# EAGLE design octosonar (EAGLE 8.2.1)
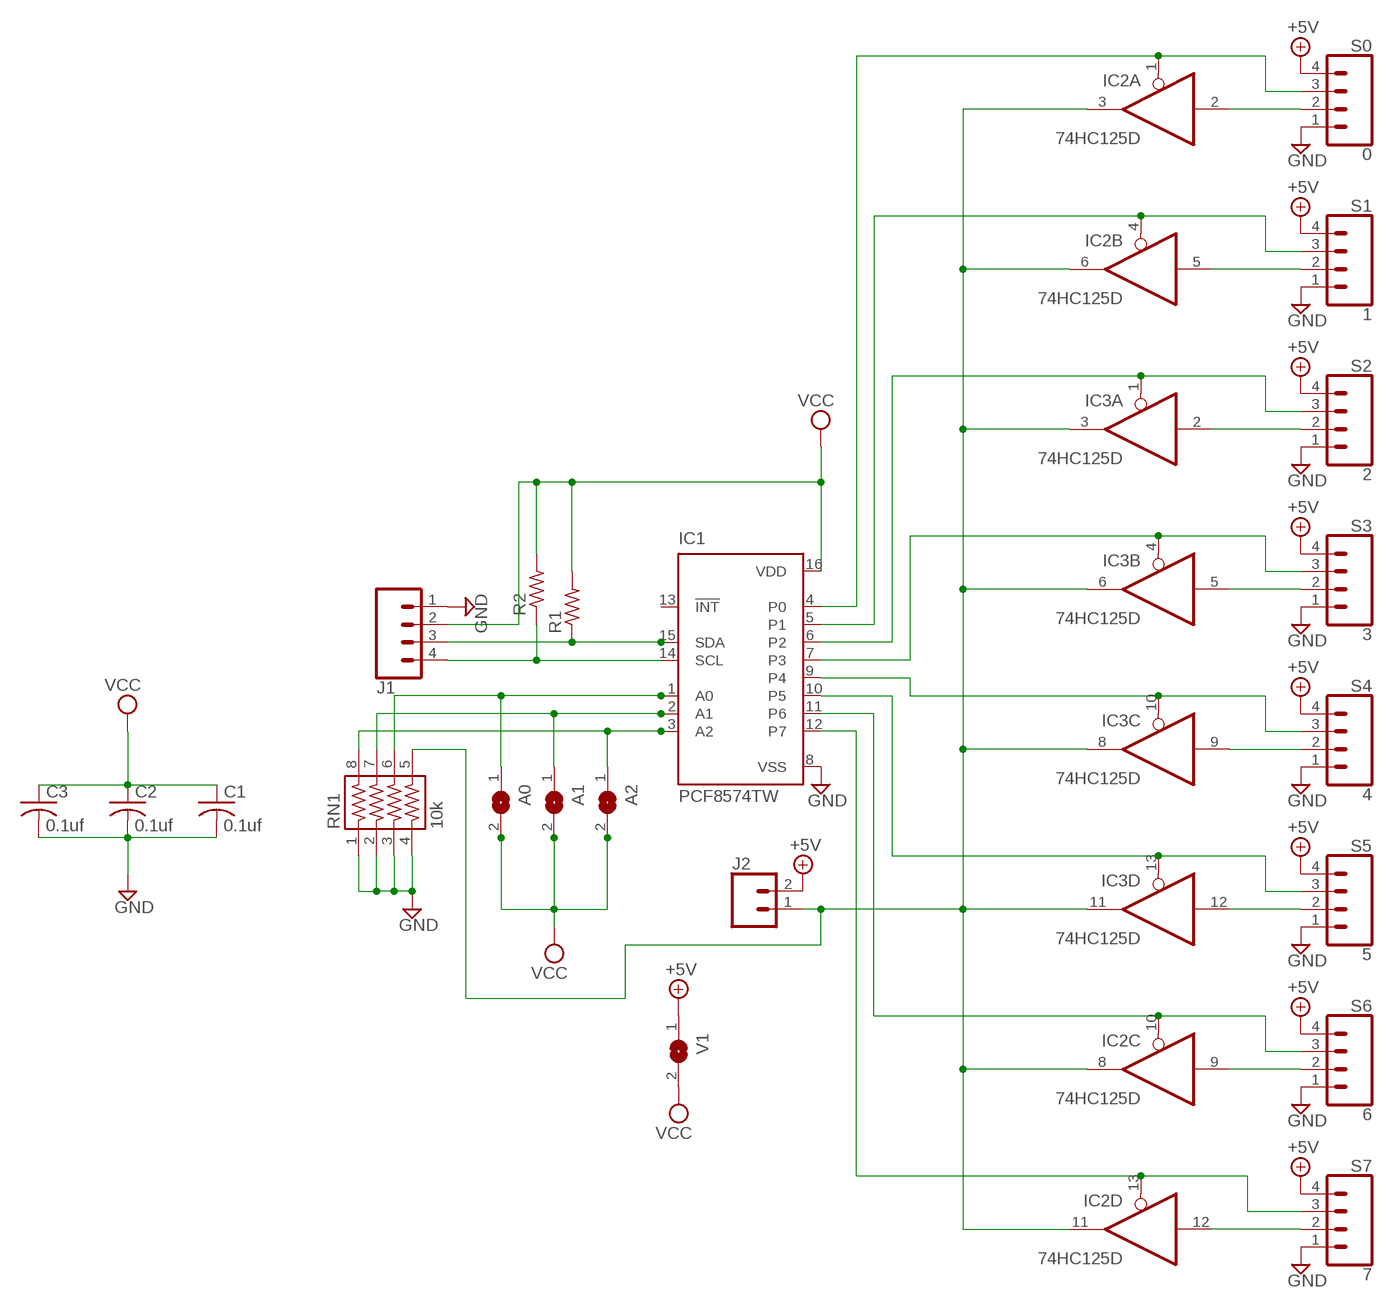
[diagram p0: schematic, sheet 1]

## Parts
A0  SJ  [SJ]
A1  SJ  [SJ]
A2  SJ  [SJ]
C1  0.1uf  C-USC0805  [C0805]
C2  0.1uf  C-USC0805  [C0805]
C3  0.1uf  C-USC0805  [C0805]
IC1  PCF8574TW  [SO16W]
IC2  74HC125D  [SO14]
IC3  74HC125D  [SO14]
J1  CONN_04POLAR_LOCK  [MOLEX-1X4_LOCK]
J2  CONN_02POLAR_LOCK  [MOLEX-1X2_LOCK]
R1  R-US_0204/2V  [0204V]
R2  R-US_0204/2V  [0204V]
RN1  10k  743-8  [743-8]
S0  0  CONN_04POLAR_LOCK  [MOLEX-1X4_LOCK]
S1  1  CONN_04POLAR_LOCK  [MOLEX-1X4_LOCK]
S2  2  CONN_04POLAR_LOCK  [MOLEX-1X4_LOCK]
S3  3  CONN_04POLAR_LOCK  [MOLEX-1X4_LOCK]
S4  4  CONN_04POLAR_LOCK  [MOLEX-1X4_LOCK]
S5  5  CONN_04POLAR_LOCK  [MOLEX-1X4_LOCK]
S6  6  CONN_04POLAR_LOCK  [MOLEX-1X4_LOCK]
S7  7  CONN_04POLAR_LOCK  [MOLEX-1X4_LOCK]
V1  SJ  [SJ]

## Nets
+5V: J2.2 S0.4 S1.4 S2.4 S3.4 S4.4 S5.4 S6.4 S7.4 V1.1
GND: C1.2 C2.2 C3.2 IC1.8(VSS) J1.1 RN1.1 RN1.2 RN1.3 RN1.4 S0.1 S1.1 S2.1 S3.1 S4.1 S5.1 S6.1 S7.1
N$1: IC1.4(P0) IC2.1(A:OE) S0.3
N$2: IC1.5(P1) IC2.4(B:OE) S1.3
N$3: IC1.6(P2) IC3.1(A:OE) S2.3
N$4: IC1.7(P3) IC3.4(B:OE) S3.3
N$5: IC1.9(P4) IC3.10(C:OE) S4.3
N$6: IC1.10(P5) IC3.13(D:OE) S5.3
N$7: IC1.11(P6) IC2.10(C:OE) S6.3
N$8: IC1.12(P7) IC2.13(D:OE) S7.3
N$9: IC2.2(A:I) S0.2
N$10: IC2.5(B:I) S1.2
N$11: IC3.2(A:I) S2.2
N$12: IC3.5(B:I) S3.2
N$13: IC3.12(D:I) S5.2
N$14: IC2.9(C:I) S6.2
N$15: IC2.12(D:I) S7.2
N$16: IC3.9(C:I) S4.2
N$17: IC2.3(A:O) IC2.6(B:O) IC2.8(C:O) IC2.11(D:O) IC3.3(A:O) IC3.6(B:O) IC3.8(C:O) IC3.11(D:O) J2.1 RN1.5
N$18: A2.1 IC1.3(A2) RN1.8
N$19: A1.1 IC1.2(A1) RN1.7
N$20: A0.1 IC1.1(A0) RN1.6
N$21: IC1.14(SCL) J1.4 R2.1
N$22: IC1.15(SDA) J1.3 R1.1
VCC: A0.2 A1.2 A2.2 C1.1 C2.1 C3.1 IC1.16(VDD) J1.2 R1.2 R2.2 V1.2
Unconnected: IC1.13(!INT)

## Power pins joined to a net without a drawn wire
GND: IC2.7(P:GND) IC3.7(P:GND)
VCC: IC2.14(P:VCC) IC3.14(P:VCC)

## Library data of the parts
A0 A1 A2 V1 = jumper:SJ: SMD solder JUMPER
C1-C3 = resistor:C-US: CAPACITOR, American symbol
IC1 = micro-philips:PCF8574: I2C-Bus Remote 8-bit I/O expander http://www.semiconductors.philips.com/acrobat_download/datasheets/PCF8574_4.pdf; MPN: PCF8574T/3,512; OC_FARNELL: 1201255; OC_NEWARK: 70R6870
IC2 IC3 = 74xx-eu:74*125: Quad bus BUFFER, 3-state
J1 S0 S1-S7 = SparkFun-Connectors:CONN_04: Multi connection point. Often used as Generic Header-pin footprint for 0.1 inch spaced/style header connections On any of the 0.1 inch spaced packages, you can populate with these: Break Away Headers - Straight <https://www.sparkfun.com/products/116> (PRT-00116) Break Away Male Headers - Right Angle <https://www.sparkfun.com/products/553> (PRT-00553) Female Headers <https://www.sparkfun.com/products/115> (PRT-00115) Break Away Headers - Machine Pin <https://www.sparkfun.com/products/117> (PRT-00117) Break Away Female Headers - Swiss Machine Pin <https://www.sparkfun.com/products/743> (PRT-00743) For SCREWTERMINALS and SPRING TERMINALS visit here: Screw Terimnals on SparkFun.com <https://www.sparkfun.com/search/results?term=Screw+Terminals> (5mm/3.5mm/2.54mm spacing) This device is also useful as a general connection point to wire up your design to another part of your project. Our various solder wires solder well into these plated through hole pads. Hook-Up Wire - Assortment (Stranded, 22 AWG) <https://www.sparkfun.com/products/11375> (PRT-11375) Hook-Up Wire - Assortment (Solid Core, 22 AWG) <https://www.sparkfun.com/products/11367> (PRT-11367) View the entire wire category on our website here <https://www.sparkfun.com/categories/141> Special notes: Molex polarized connector foot print use with SKU : PRT-08231 with associated crimp pins and housings. 1MM SMD Version SKU: PRT-10208; PROD_ID: CONN-08186; SF_ID: PRT-08231
J2 = SparkFun-Connectors:CONN_02: Multi connection point. Often used as Generic Header-pin footprint for 0.1 inch spaced/style header connections On any of the 0.1 inch spaced packages, you can populate with these: Break Away Headers - Straight <https://www.sparkfun.com/products/116> (PRT-00116) Break Away Male Headers - Right Angle <https://www.sparkfun.com/products/553> (PRT-00553) Female Headers <https://www.sparkfun.com/products/115> (PRT-00115) Break Away Headers - Machine Pin <https://www.sparkfun.com/products/117> (PRT-00117) Break Away Female Headers - Swiss Machine Pin <https://www.sparkfun.com/products/743> (PRT-00743) For SCREWTERMINALS and SPRING TERMINALS visit here: Screw Terimnals on SparkFun.com <https://www.sparkfun.com/search/results?term=Screw+Terminals> (5mm/3.5mm/2.54mm spacing) This device is also useful as a general connection point to wire up your design to another part of your project. Our various solder wires solder well into these plated through hole pads. Hook-Up Wire - Assortment (Stranded, 22 AWG) <https://www.sparkfun.com/products/11375> (PRT-11375) Hook-Up Wire - Assortment (Solid Core, 22 AWG) <https://www.sparkfun.com/products/11367> (PRT-11367) View the entire wire category on our website here <https://www.sparkfun.com/categories/141> Special notes: Molex polarized connector foot print use with: PRT-08233 with associated crimp pins and housings. 2.54_SCREWTERM for use with PRT-10571. 3.5mm Screw Terminal footprints for PRT-08084 5mm Screw Terminal footprints for use with PRT-08432; SF_ID: PRT-09918
R1 R2 = rcl:R-US_: RESISTOR, American symbol
RN1 = resistor-array:743-8: CTS 743 Series 8 Terminations, 4 Resistors

## Board
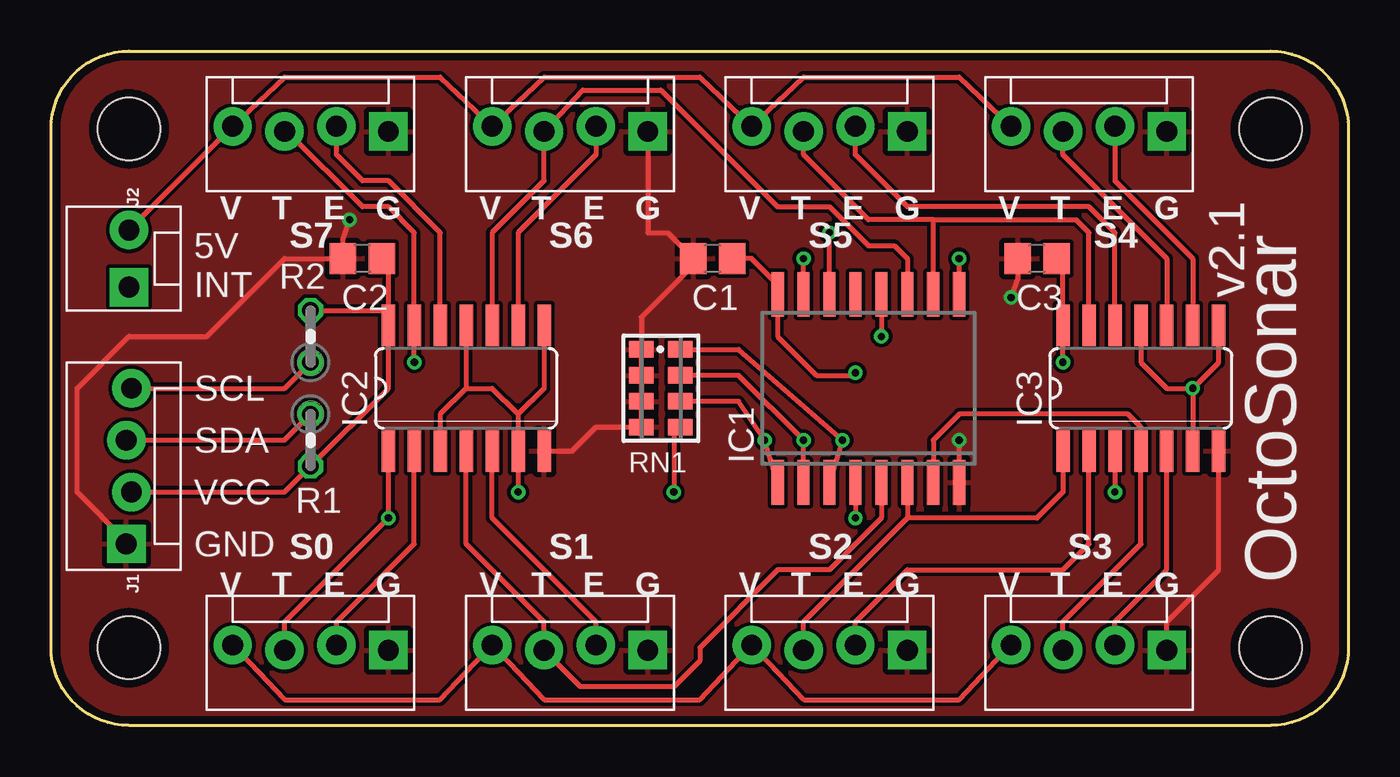
[diagram p1: board, top side]
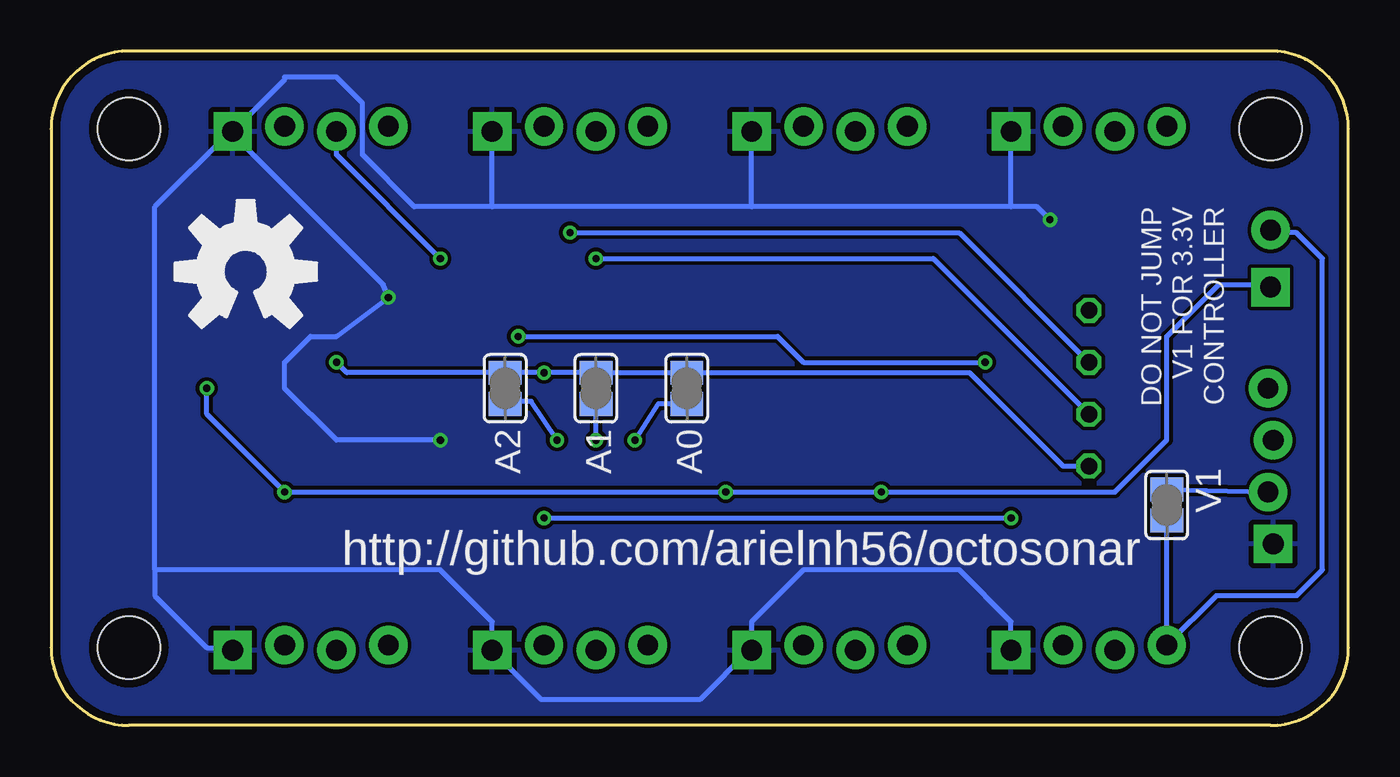
[diagram p2: board, bottom side, seen from below]

Size 63.5 x 33.02 mm. Coordinates in mm from the lower left corner, seen from the top.
Outline: 3.81,0 59.69,0 arc90 63.5,3.81 63.5,29.21 arc90 59.69,33.02 3.81,33.02 arc90 0,29.21 0,3.81 arc90 3.81,0
Copper layers (1*16): Top 0.0356mm / dielectric 1.5011mm / Bottom 0.0356mm
Design rules "mypcbway *": minimum track width 6mil, minimum drill 13mil, track to track 7mil, track to pad 7mil, pad to pad 7mil, via to via 7mil, smd to smd 7mil, copper to edge 15mil, drill to drill 6mil, minimum pad ring 7mil, minimum via ring 7mil, stop-mask expansion 2.5mil, vias tented up to drill 20mil, thermal gap 10mil

### Footprints (pad centres in the part's own frame; a part is rotated, then mirrored left to right if it is on the bottom)
SJ = smd 1.168 x 1.6: 1 -0.762,0; 2 0.762,0
C0805 = smd 1.3 x 1.5: 1 -0.95,0; 2 0.95,0
SO16W = smd 0.6 x 2.2: 1 -4.445,-4.6; 2 -3.175,-4.6; 3 -1.905,-4.6; 4 -0.635,-4.6; 5 0.635,-4.6; 6 1.905,-4.6; 7 3.175,-4.6; 8 4.445,-4.6; 9 4.445,4.6; 10 3.175,4.6; 11 1.905,4.6; 12 0.635,4.6; 13 -0.635,4.6; 14 -1.905,4.6; 15 -3.175,4.6; 16 -4.445,4.6
SO14 = smd 0.66 x 2.032: 1 -3.81,-3.073; 2 -2.54,-3.073; 3 -1.27,-3.073; 4 0,-3.073; 5 1.27,-3.073; 6 2.54,-3.073; 7 3.81,-3.073; 8 3.81,3.073; 9 2.54,3.073; 10 1.27,3.073; 11 0,3.073; 12 -1.27,3.073; 13 -2.54,3.073; 14 -3.81,3.073
MOLEX-1X4_LOCK = drill 1.016 pad 1.88 square: 1 0,0.127 | drill 1.016 pad 1.88: 2 2.54,-0.127; 3 5.08,0.127; 4 7.62,-0.127
MOLEX-1X2_LOCK = drill 1.016 pad 1.88 square: 1 -0.127,0 | drill 1.016 pad 1.88: 2 2.667,0
0204V = drill 0.813 octagon: 1 -1.27,0; 2 1.27,0
743-8 = smd 0.8 x 1.2: 1 -1.905,-0.953; 2 -0.635,-0.953; 3 0.635,-0.953; 4 1.905,-0.953; 5 1.905,0.953; 6 0.635,0.953; 7 -0.635,0.953; 8 -1.905,0.953
STAND-OFF-TIGHT = hole 3.048: 0,0

### Placement (x,y rotation side)
A0  32.38,16.51 90 bottom
A1  36.83,16.51 90 bottom
A2  41.27,16.51 90 bottom
C1  32.38,22.86 180 top
C2  15.24,22.86 180 top
C3  48.26,22.86 180 top
IC1  40.01,16.51 0 top
IC2  20.32,16.51 0 top
IC3  53.34,16.51 0 top
J1  3.81,8.89 90 top
J2  3.81,21.59 90 top
R1  12.7,13.97 270 top
R2  12.7,19.05 90 top
RN1  29.84,16.51 270 top
S0  16.51,3.81 180 top
S1  29.21,3.81 180 top
S2  41.91,3.81 180 top
S3  54.61,3.81 180 top
S4  54.61,29.21 180 top
S5  41.91,29.21 180 top
S6  29.21,29.21 180 top
S7  16.51,29.21 180 top
U$1  [STAND-OFF-TIGHT]  3.81,3.81 0 top
U$2  [STAND-OFF-TIGHT]  3.81,29.21 0 top
U$3  [STAND-OFF-TIGHT]  59.69,29.21 0 top
U$4  [STAND-OFF-TIGHT]  59.69,3.81 0 top
U$5  [OSHW-LOGO-L]  53.98,22.23 0 bottom
V1  8.89,10.79 90 bottom

### Tracks (layer width: path | path; a pad name or v marks a point on that pad's centre or on a via)
+5V
  Top 0.254: J2.2 S7.4 11.43,31.75 19.05,31.75 S6.4 24.13,31.75 31.75,31.75 S5.4 36.83,31.75 44.45,31.75 S4.4 | S0.4 11.43,1.27 19.05,1.27 S1.4 24.13,1.27 31.75,1.27 S2.4 36.83,1.27 44.45,1.27 S3.4
  Bottom 0.254: V1.1 S0.4 6.48,6.35 2.54,6.35 1.27,7.62 1.27,22.86 2.54,24.13 3.68,24.13 J2.2 3.81,24.13
GND  (via drill 0.35)
  Top 0.254: J1.1 3.68,9.02 1.27,11.43 1.27,16.51 3.81,19.05 7.62,19.05 11.43,22.86 C2.2 14.29,23.81 v14.61,24.77 | S6.1 29.21,24.13 30.16,24.13 C1.2 31.43,22.55 28.89,20 RN1.1 RN1.2 RN1.3 RN1.4 26.67,14.61 25.5,13.44 IC2.7 | S3.1 54.61,5.08 57.15,7.62 IC3.7 | C3.2 47.31,21.91 v46.99,20.95 | IC1.8 v44.45,13.97
  Bottom 0.254: 16.51,25.4 S7.1 | 16.51,25.4 29.21,25.4 | 29.21,25.4 S6.1 | 29.21,25.4 41.91,25.4 | 41.91,25.4 S5.1 | 41.91,25.4 45.72,25.4 48.26,27.94 48.26,30.48 49.53,31.75 52.07,31.75 52.07,31.62 S4.1 54.74,29.08 | 54.74,29.08 58.42,25.4 58.42,7.62 | 58.42,7.62 58.42,6.35 55.88,3.81 54.74,3.81 S3.1 | 58.42,7.62 44.45,7.62 41.91,5.08 S2.1 39.5,1.27 31.75,1.27 29.34,3.68 S1.1 29.21,5.08 26.67,7.62 19.05,7.62 16.51,5.08 S0.1 | 54.74,29.08 47.24,21.59 v46.99,20.95 49.53,19.05 50.8,19.05 52.07,17.78 52.07,16.51 49.53,13.97 v44.45,13.97 | v14.61,24.77 15.24,25.4 16.51,25.4
  pour Bottom: 3.81,33.02 59.69,33.02 arc-90 63.5,29.21 63.5,3.81 arc-90 59.69,0 3.81,0 arc-90 0,3.81 0,29.21 arc-90
  pour Top: 0,3.81 0,29.21 arc-90 3.81,33.02 59.69,33.02 arc-90 63.5,29.21 63.5,3.81 arc-90 59.69,0 3.81,0 arc-90
N$1  (via drill 0.35)
  Top 0.254: S0.3 11.43,5.08 v16.51,10.16 IC2.1 | IC1.4 v39.37,10.16
  Bottom 0.254: v39.37,10.16 v16.51,10.16
N$2
  Top 0.254: IC2.4 20.32,8.89 24.13,5.08 S1.3 25.91,1.91 30.48,1.91 31.75,3.17 31.75,3.81 35.56,7.62 38.1,7.62 40.64,10.16 IC1.5
N$3
  Top 0.254: S2.3 36.83,5.08 41.91,10.16 | IC1.6 41.91,10.16 | IC3.1 49.53,11.43 48.26,10.16 41.91,10.16
N$4
  Top 0.254: S3.3 49.53,5.08 53.34,8.89 IC3.4 53.34,14.61 52.7,15.24 44.45,15.24 43.18,13.97 IC1.7
N$5  (via drill 0.35)
  Top 0.254: IC3.10 54.61,22.86 49.53,27.94 S4.3 | IC1.9 v44.45,22.86
  Bottom 0.254: v44.45,22.86 49.53,27.94 S4.3
N$6
  Top 0.254: 43.18,24.77 50.16,24.77 50.8,24.13 IC3.13 | 43.18,24.77 40.01,24.77 36.83,27.94 S5.3 | IC1.10 43.18,24.77
N$7
  Top 0.254: IC2.10 21.59,24.13 24.13,26.67 S6.3 26.04,31.11 29.84,31.11 35.56,25.4 38.1,25.4 40.01,23.5 41.27,23.5 41.91,22.86 IC1.11
N$8  (via drill 0.35)
  Top 0.254: S7.3 11.56,29.08 15.24,25.4 16.51,25.4 17.78,24.13 IC2.13 v17.78,17.78 | IC1.12 v40.64,19.05
  Bottom 0.254: v40.64,19.05 27.94,19.05 26.67,17.78 v17.78,17.78
N$9
  Top 0.254: S0.2 13.97,5.08 17.78,8.89 IC2.2
N$10
  Top 0.254: S1.2 26.67,5.08 21.59,10.16 IC2.5
N$11
  Top 0.254: S2.2 39.37,5.08 41.91,7.62 49.53,7.62 50.8,8.89 IC3.2
N$12
  Top 0.254: S3.2 52.07,5.08 54.61,7.62 IC3.5
N$13
  Top 0.254: IC3.12 52.07,24.13 50.8,25.4 41.91,25.4 39.37,27.94 S5.2
N$14
  Top 0.254: S6.2 26.67,27.94 22.86,24.13 IC2.9
N$15
  Top 0.254: S7.2 13.97,27.94 15.24,26.67 16.51,26.67 19.05,24.13 IC2.12
N$16
  Top 0.254: S4.2 52.07,26.67 55.88,22.86 IC3.9
N$17  (via drill 0.35)
  Top 0.254: v22.86,11.43 IC2.6 22.86,15.24 | v55.88,16.51 IC3.6 | v55.88,16.51 57.15,17.78 IC3.8 | IC3.11 53.34,17.78 54.61,16.51 v55.88,16.51 | IC3.3 v52.07,11.43 | IC2.11 20.32,16.51 | 20.32,16.51 19.05,15.24 IC2.3 | 20.32,16.51 21.59,16.51 22.86,15.24 | RN1.5 30.48,14.61 v30.48,11.43 | IC2.8 24.13,16.51 22.86,15.24
  Bottom 0.254: v55.88,16.51 55.88,15.24 v52.07,11.43 v30.48,11.43 v22.86,11.43 11.43,11.43 8.89,13.97 8.89,19.05 6.35,21.59 3.94,21.59 J2.1
N$18  (via drill 0.35)
  Top 0.254: IC1.3 v38.73,13.97 33.66,18.41 RN1.8
  Bottom 0.254: v38.73,13.97 40.01,15.88 41.15,15.88 A2.1
N$19  (via drill 0.35)
  Top 0.254: IC1.2 v36.83,13.97 33.66,17.14 RN1.7
  Bottom 0.254: v36.83,13.97 A1.1
N$20  (via drill 0.35)
  Top 0.254: IC1.1 v34.92,13.97 33.66,15.88 RN1.6
  Bottom 0.254: 34.8,13.97 v34.92,13.97 33.78,15.75 A0.1
N$21  (via drill 0.35)
  Top 0.254: IC1.14 v38.1,24.13 | J1.4 11.43,16.51 R2.1
  Bottom 0.254: v38.1,24.13 19.05,24.13 R2.1
N$22  (via drill 0.35)
  Top 0.254: IC1.15 v36.83,22.86 | J1.3 11.43,13.97 R1.1
  Bottom 0.254: v36.83,22.86 20.32,22.86 R1.1
VCC  (via drill 0.35)
  Top 0.254: C3.1 49.53,22.54 IC3.14 v49.53,17.78 | C1.1 34.29,22.86 35.56,21.59 IC1.16 35.56,19.05 37.47,17.14 39.24,17.14 v39.37,17.27 | IC2.14 16.51,20.32 R2.2 | 16.51,19.05 IC2.14 | J1.2 11.43,11.43 R1.2 16.51,16.51 IC2.14 | IC2.14 16.51,22.54 C2.1
  Bottom 0.254: V1.2 J1.2 | R1.2 13.97,12.7 18.54,17.27 A0.2 A1.2 v39.37,17.27 A2.2 49.02,17.27 v49.53,17.78

### Text on the board
tPlace: V | T | E | G | V | T | E | G | V | T | E | G | V | T | E | G | 5V | INT | v2.1 | SCL | SDA | VCC | GND | OctoSonar | V | T | E | G | V | T | E | G | V | T | E | G | V | T | E | G
bPlace: DO NOT JUMP / V1 FOR 3.3V / CONTROLLER | http://github.com/arielnh56/octosonar